# EasyEDA schematic SCH_STM8-点阵驱动板_2022-05-08.json
TITLE: Sheet_1; REV: 1.0; Date: 2021-10-12; Sheet: 1/1; Drawn By: pomin; Company: Your Company
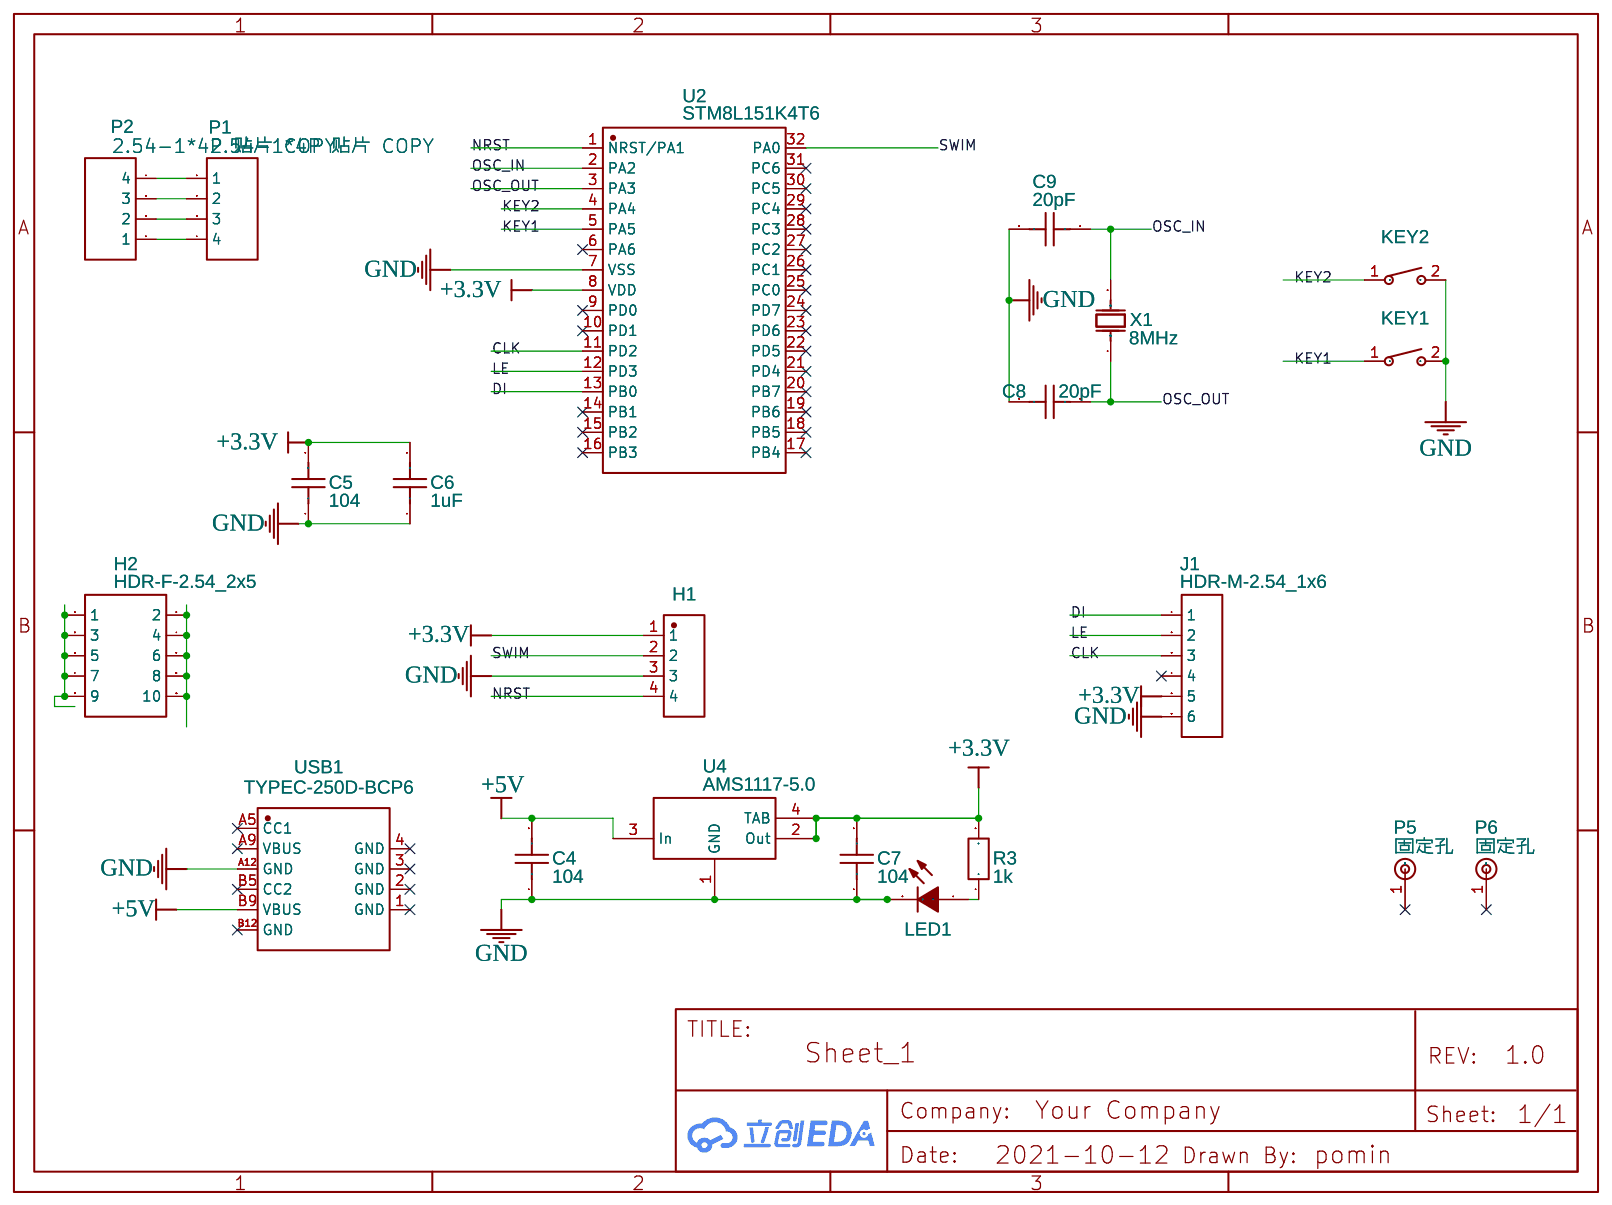
[diagram p0: schematic sheet]

## Parts
C4  104  [C0805]
C5  104  [C0805]
C6  1uF  [C0805]
C7  104  [C0805]
C8  20pF  [C0805]
C9  20pF  [C0805]
H1  2.54-1*4P母  [HDR-TH_4P-P2.54-V-F]
H2  HDR-F-2.54_2x5  [HDR-F-2.54_2X5]
J1  HDR-M-2.54_1x6  [HDR-M-2.54_1X6]
KEY1  UK-B0227-G4.3-160-W-JZ  [SW-SMD_L6.0-W3.5-LS8.0]
KEY2  UK-B0227-G4.3-160-W-JZ  [SW-SMD_L6.0-W3.5-LS8.0]
LED1  17-21SURC/S530-A3/TR8  [LED0805-R-RD]
P1  2.54-1*4P 贴片 COPY  [2.54-1X4P 贴片封装]
P2  2.54-1*4P 贴片 COPY  [2.54-1X4P 贴片封装]
P5  固定孔  [铜柱孔]
P6  固定孔  [铜柱孔]
R3  1k  [R0805]
U2  STM8L151K4T6  [LQFP-32_L7.0-W7.0-P0.80-LS9.0-BL]
U4  AMS1117-5.0  [SOT-223_L6.5-W3.5-P2.30-LS7.0-BR]
USB1  TYPEC-250D-BCP6  [USB-C]
X1  8MHz  [HC-49S_L11.4-W4.8]

## Library data of the parts
C4 C7 = C_0805_US: Contributor: LCEDA_Lib
C5 C6 = CC0805JRX7R9BB563: Supplier: LCSC; Supplier Part: C520045; Manufacturer: YAGEO; Contributor: LCSC
C8 C9 = C_0603_US: Contributor: LCEDA_Lib
H1 = 2.54-1*4P母: Supplier: LCSC; Supplier Part: C2718488; Manufacturer: BOOMELE(博穆精密); Contributor: LCSC; JLCPCB Part Class: Extended Part
H2 = HDR-F-2.54_2x5: Supplier Part: C30419; Supplier: LCSC; Contributor: LCEDA_Lib
J1 = HDR-M-2.54_1x6: Supplier Part: C190819; Supplier: LCSC; Contributor: LCEDA_Lib
KEY1 KEY2 = UK-B0227-G4.3-160-W-JZ: Supplier: LCSC; Supplier Part: C620345; Manufacturer: USAKRO; Contributor: LCSC
LED1 = 17-21SURC/S530-A3/TR8: Supplier: LCSC; Manufacturer: EVERLIGHT; image: //image.lceda.cn/szlcsc/C72037.jpg; Supplier Part: C72037; SMT Type: Extend; JLCPCB SMD: Yes
P1 P2 = 2.54-1*4P 贴片 COPY: Supplier: LCSC; Manufacturer: HeZo; Manufacturer Part: 2.54-1*4P; Supplier Part: C52709; Contributor: 徐州合卓技术服务
P5 P6 = 固定孔: Contributor: XianYong
R3 = R_0201_EU: Contributor: LCEDA_Lib
U2 = STM8L151K4T6: Supplier: LCSC; Manufacturer: STMicroelectronics; Supplier Part: C18719; JLCPCB Part Class: Extended Part
U4 = AMS1117-5.0: sourceId: HltLFyQwq; Supplier: LCSC; Manufacturer: AMS; Supplier Part: C6187; JLCPCB Part Class: Basic Part
USB1 = TYPEC-250D-BCP6: Supplier: LCSC; Supplier Part: C720626; Manufacturer: XUNPU; Contributor: LCSC
X1 = 9C1105LCSC-AAK2S: Supplier: LCSC; Manufacturer: TXC; Supplier Part: C90938

## Nets
+3.3V: C5.2 C6.2 C7.2 H1.1 J1.5 R3.2 U2.8(VDD) U4.2(Out) U4.4(TAB)
+5V: C4.2 U4.3(In) USB1.B9(VBUS)
GND: C4.1 C5.1 C6.1 C7.1 C8.2 C9.2 H1.3 J1.6 KEY1.2 KEY2.2 LED1.2(C) U2.7(VSS) U4.1(GND) USB1.A12(GND)
CLK: J1.3 U2.11(PD2)
DI: J1.1 U2.13(PB0)
KEY1: KEY1.1 U2.5(PA5)
KEY2: KEY2.1 U2.4(PA4)
LE: J1.2 U2.12(PD3)
NRST: H1.4 U2.1(NRST/PA1)
OSC_IN: C9.1 U2.2(PA2) X1.2(OSC2)
OSC_OUT: C8.1 U2.3(PA3) X1.1(OSC1)
SWIM: H1.2 U2.32(PA0)
Net-(H2-1): H2.1 H2.3 H2.5 H2.7 H2.9
Net-(H2-2): H2.2 H2.4 H2.6 H2.8 H2.10
Net-(LED1-1): LED1.1(A) R3.1
Net-(P1-1): P1.1 P2.4
Net-(P1-2): P1.2 P2.3
Net-(P1-3): P1.3 P2.2
Net-(P1-4): P1.4 P2.1

Not connected (* = marked no-connect by the designer): J1 4*; P5 1(3mm洞)*; P6 1(3mm洞)*; U2 6(PA6)* 9(PD0)* 10(PD1)* 14(PB1)* 15(PB2)* 16(PB3)* 17(PB4)* 18(PB5)* 19(PB6)* 20(PB7)* 21(PD4)* 22(PD5)* 23(PD6)* 24(PD7)* 25(PC0)* 26(PC1)* 27(PC2)* 28(PC3)* 29(PC4)* 30(PC5)* 31(PC6)*; USB1 1(GND)* 2(GND)* 3(GND)* 4(GND)* A5(CC1)* A9(VBUS)* B5(CC2)* B12(GND)*
